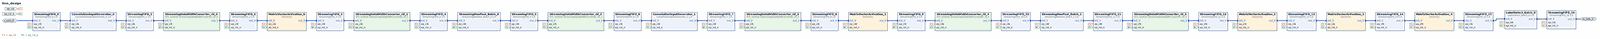
[diagram p0: block diagram of the top level, whole]
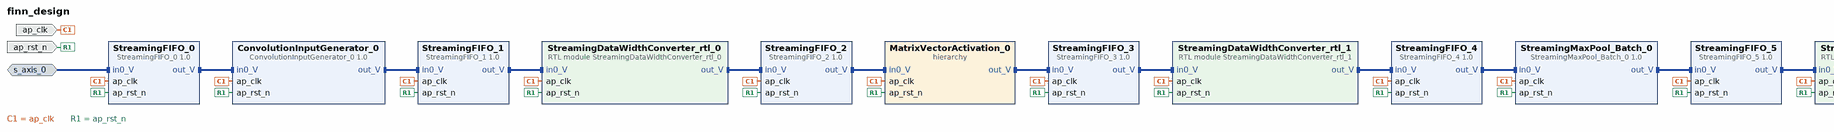
[diagram p1: block diagram of the top level, left part]
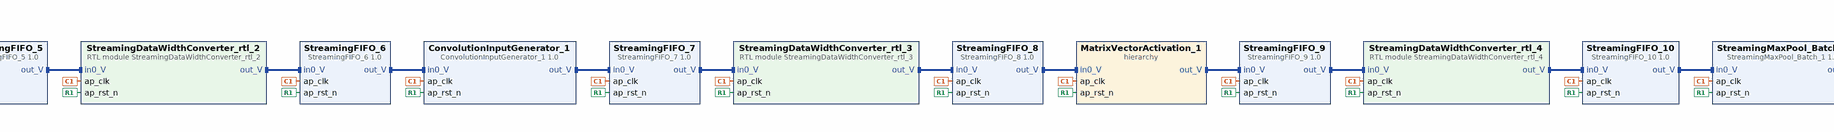
[diagram p2: block diagram of the top level, centre part]
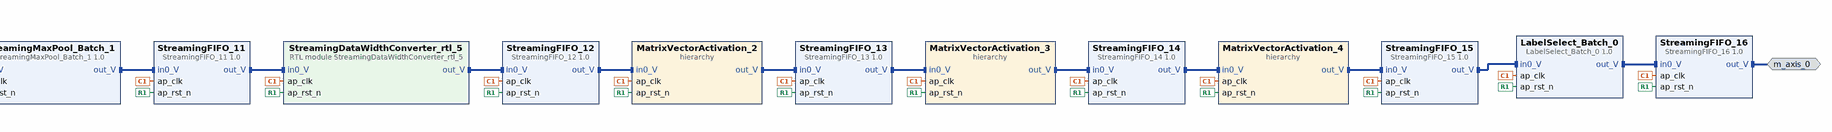
[diagram p3: block diagram of the top level, right part]
# Vivado block design finn_design, xck26-sfvc784-2LV-c, Vivado 2022.1
create_bd_design finn_design

create_bd_intf_port -mode Slave -vlnv xilinx.com:interface:axis_rtl:1.0 s_axis_0
set_property -dict [list \
  CONFIG.HAS_TKEEP 0 \
  CONFIG.HAS_TLAST 0 \
  CONFIG.HAS_TREADY 1 \
  CONFIG.HAS_TSTRB 0 \
  CONFIG.LAYERED_METADATA undef \
  CONFIG.TDATA_NUM_BYTES 1 \
  CONFIG.TDEST_WIDTH 0 \
  CONFIG.TID_WIDTH 0 \
  CONFIG.TUSER_WIDTH 0 \
] [get_bd_intf_ports s_axis_0]
create_bd_intf_port -mode Master -vlnv xilinx.com:interface:axis_rtl:1.0 m_axis_0
create_bd_port -dir I -type clk ap_clk
set_property -dict {CONFIG.FREQ_HZ 100000000} [get_bd_ports ap_clk]
create_bd_port -dir I -type rst ap_rst_n

create_bd_cell -type ip -vlnv xilinx.com:hls:StreamingFIFO_0:1.0 StreamingFIFO_0
create_bd_cell -type ip -vlnv xilinx.com:hls:ConvolutionInputGenerator_0:1.0 ConvolutionInputGenerator_0
create_bd_cell -type ip -vlnv xilinx.com:hls:StreamingFIFO_1:1.0 StreamingFIFO_1
create_bd_cell -type module -reference StreamingDataWidthConverter_rtl_0 StreamingDataWidthConverter_rtl_0
create_bd_cell -type ip -vlnv xilinx.com:hls:StreamingFIFO_2:1.0 StreamingFIFO_2
create_bd_cell -type hier MatrixVectorActivation_0
create_bd_cell -type ip -vlnv xilinx.com:hls:StreamingFIFO_3:1.0 StreamingFIFO_3
create_bd_cell -type module -reference StreamingDataWidthConverter_rtl_1 StreamingDataWidthConverter_rtl_1
create_bd_cell -type ip -vlnv xilinx.com:hls:StreamingFIFO_4:1.0 StreamingFIFO_4
create_bd_cell -type ip -vlnv xilinx.com:hls:StreamingMaxPool_Batch_0:1.0 StreamingMaxPool_Batch_0
create_bd_cell -type ip -vlnv xilinx.com:hls:StreamingFIFO_5:1.0 StreamingFIFO_5
create_bd_cell -type module -reference StreamingDataWidthConverter_rtl_2 StreamingDataWidthConverter_rtl_2
create_bd_cell -type ip -vlnv xilinx.com:hls:StreamingFIFO_6:1.0 StreamingFIFO_6
create_bd_cell -type ip -vlnv xilinx.com:hls:ConvolutionInputGenerator_1:1.0 ConvolutionInputGenerator_1
create_bd_cell -type ip -vlnv xilinx.com:hls:StreamingFIFO_7:1.0 StreamingFIFO_7
create_bd_cell -type module -reference StreamingDataWidthConverter_rtl_3 StreamingDataWidthConverter_rtl_3
create_bd_cell -type ip -vlnv xilinx.com:hls:StreamingFIFO_8:1.0 StreamingFIFO_8
create_bd_cell -type hier MatrixVectorActivation_1
create_bd_cell -type ip -vlnv xilinx.com:hls:StreamingFIFO_9:1.0 StreamingFIFO_9
create_bd_cell -type module -reference StreamingDataWidthConverter_rtl_4 StreamingDataWidthConverter_rtl_4
create_bd_cell -type ip -vlnv xilinx.com:hls:StreamingFIFO_10:1.0 StreamingFIFO_10
create_bd_cell -type ip -vlnv xilinx.com:hls:StreamingMaxPool_Batch_1:1.0 StreamingMaxPool_Batch_1
create_bd_cell -type ip -vlnv xilinx.com:hls:StreamingFIFO_11:1.0 StreamingFIFO_11
create_bd_cell -type module -reference StreamingDataWidthConverter_rtl_5 StreamingDataWidthConverter_rtl_5
create_bd_cell -type ip -vlnv xilinx.com:hls:StreamingFIFO_12:1.0 StreamingFIFO_12
create_bd_cell -type hier MatrixVectorActivation_2
create_bd_cell -type ip -vlnv xilinx.com:hls:StreamingFIFO_13:1.0 StreamingFIFO_13
create_bd_cell -type hier MatrixVectorActivation_3
create_bd_cell -type ip -vlnv xilinx.com:hls:StreamingFIFO_14:1.0 StreamingFIFO_14
create_bd_cell -type hier MatrixVectorActivation_4
create_bd_cell -type ip -vlnv xilinx.com:hls:StreamingFIFO_15:1.0 StreamingFIFO_15
create_bd_cell -type ip -vlnv xilinx.com:hls:LabelSelect_Batch_0:1.0 LabelSelect_Batch_0
create_bd_cell -type ip -vlnv xilinx.com:hls:StreamingFIFO_16:1.0 StreamingFIFO_16

# ---- hierarchy /MatrixVectorActivation_0 ----
current_bd_instance /MatrixVectorActivation_0
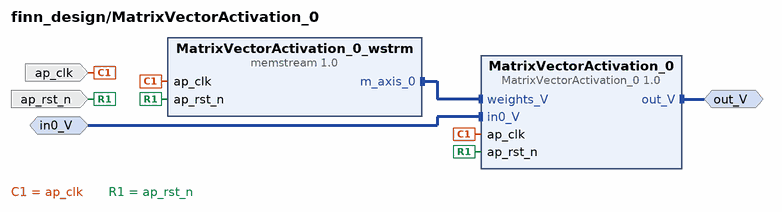
[diagram p4: block diagram inside /MatrixVectorActivation_0]
create_bd_intf_pin -mode Master -vlnv xilinx.com:interface:axis_rtl:1.0 out_V
create_bd_intf_pin -mode Slave -vlnv xilinx.com:interface:axis_rtl:1.0 in0_V
create_bd_pin -dir I -type clk ap_clk
create_bd_pin -dir I -type rst ap_rst_n

create_bd_cell -type ip -vlnv xilinx.com:hls:MatrixVectorActivation_0:1.0 MatrixVectorActivation_0
create_bd_cell -type ip -vlnv amd.com:finn:memstream:1.0 MatrixVectorActivation_0_wstrm
set_property -dict [list \
  CONFIG.DEPTH 6 \
  CONFIG.INIT_FILE /tmp/finn_dev_vboxuser/code_gen_ipgen_MatrixVectorActivation_0_2lsh2_ub/memblock.dat \
  CONFIG.RAM_STYLE auto \
  CONFIG.WIDTH 200 \
] [get_bd_cells MatrixVectorActivation_0_wstrm]

# ---- hierarchy /MatrixVectorActivation_1 ----
current_bd_instance /MatrixVectorActivation_1
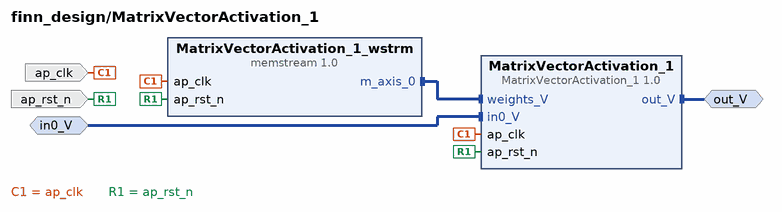
[diagram p5: block diagram inside /MatrixVectorActivation_1]
create_bd_intf_pin -mode Master -vlnv xilinx.com:interface:axis_rtl:1.0 out_V
create_bd_intf_pin -mode Slave -vlnv xilinx.com:interface:axis_rtl:1.0 in0_V
create_bd_pin -dir I -type clk ap_clk
create_bd_pin -dir I -type rst ap_rst_n

create_bd_cell -type ip -vlnv xilinx.com:hls:MatrixVectorActivation_1:1.0 MatrixVectorActivation_1
create_bd_cell -type ip -vlnv amd.com:finn:memstream:1.0 MatrixVectorActivation_1_wstrm
set_property -dict [list \
  CONFIG.DEPTH 160 \
  CONFIG.INIT_FILE /tmp/finn_dev_vboxuser/code_gen_ipgen_MatrixVectorActivation_1_3e8pn67s/memblock.dat \
  CONFIG.RAM_STYLE auto \
  CONFIG.WIDTH 120 \
] [get_bd_cells MatrixVectorActivation_1_wstrm]

# ---- hierarchy /MatrixVectorActivation_2 ----
current_bd_instance /MatrixVectorActivation_2
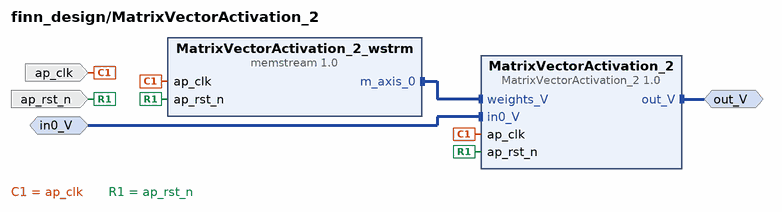
[diagram p6: block diagram inside /MatrixVectorActivation_2]
create_bd_intf_pin -mode Master -vlnv xilinx.com:interface:axis_rtl:1.0 out_V
create_bd_intf_pin -mode Slave -vlnv xilinx.com:interface:axis_rtl:1.0 in0_V
create_bd_pin -dir I -type clk ap_clk
create_bd_pin -dir I -type rst ap_rst_n

create_bd_cell -type ip -vlnv xilinx.com:hls:MatrixVectorActivation_2:1.0 MatrixVectorActivation_2
create_bd_cell -type ip -vlnv amd.com:finn:memstream:1.0 MatrixVectorActivation_2_wstrm
set_property -dict [list \
  CONFIG.DEPTH 12000 \
  CONFIG.INIT_FILE /tmp/finn_dev_vboxuser/code_gen_ipgen_MatrixVectorActivation_2_bhbpvrcf/memblock.dat \
  CONFIG.RAM_STYLE auto \
  CONFIG.WIDTH 32 \
] [get_bd_cells MatrixVectorActivation_2_wstrm]

# ---- hierarchy /MatrixVectorActivation_3 ----
current_bd_instance /MatrixVectorActivation_3
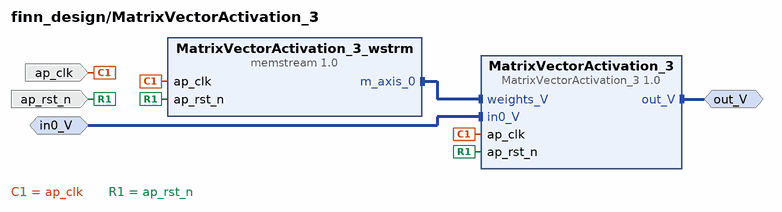
[diagram p7: block diagram inside /MatrixVectorActivation_3]
create_bd_intf_pin -mode Master -vlnv xilinx.com:interface:axis_rtl:1.0 out_V
create_bd_intf_pin -mode Slave -vlnv xilinx.com:interface:axis_rtl:1.0 in0_V
create_bd_pin -dir I -type clk ap_clk
create_bd_pin -dir I -type rst ap_rst_n

create_bd_cell -type ip -vlnv xilinx.com:hls:MatrixVectorActivation_3:1.0 MatrixVectorActivation_3
create_bd_cell -type ip -vlnv amd.com:finn:memstream:1.0 MatrixVectorActivation_3_wstrm
set_property -dict [list \
  CONFIG.DEPTH 10080 \
  CONFIG.INIT_FILE /tmp/finn_dev_vboxuser/code_gen_ipgen_MatrixVectorActivation_3_sp5zjdwm/memblock.dat \
  CONFIG.RAM_STYLE auto \
  CONFIG.WIDTH 8 \
] [get_bd_cells MatrixVectorActivation_3_wstrm]

# ---- hierarchy /MatrixVectorActivation_4 ----
current_bd_instance /MatrixVectorActivation_4
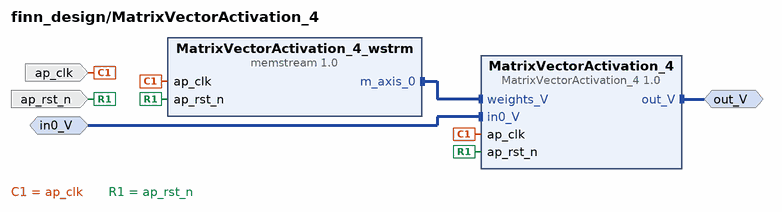
[diagram p8: block diagram inside /MatrixVectorActivation_4]
create_bd_intf_pin -mode Master -vlnv xilinx.com:interface:axis_rtl:1.0 out_V
create_bd_intf_pin -mode Slave -vlnv xilinx.com:interface:axis_rtl:1.0 in0_V
create_bd_pin -dir I -type clk ap_clk
create_bd_pin -dir I -type rst ap_rst_n

create_bd_cell -type ip -vlnv xilinx.com:hls:MatrixVectorActivation_4:1.0 MatrixVectorActivation_4
create_bd_cell -type ip -vlnv amd.com:finn:memstream:1.0 MatrixVectorActivation_4_wstrm
set_property -dict [list \
  CONFIG.DEPTH 840 \
  CONFIG.INIT_FILE /tmp/finn_dev_vboxuser/code_gen_ipgen_MatrixVectorActivation_4_2oobzu4d/memblock.dat \
  CONFIG.RAM_STYLE auto \
  CONFIG.WIDTH 8 \
] [get_bd_cells MatrixVectorActivation_4_wstrm]

# ---- connections ----

current_bd_instance /MatrixVectorActivation_0
connect_bd_intf_net [get_bd_intf_pins out_V] [get_bd_intf_pins MatrixVectorActivation_0/out_V]
connect_bd_intf_net [get_bd_intf_pins MatrixVectorActivation_0_wstrm/m_axis_0] [get_bd_intf_pins MatrixVectorActivation_0/weights_V]
connect_bd_intf_net [get_bd_intf_pins in0_V] [get_bd_intf_pins MatrixVectorActivation_0/in0_V]
connect_bd_net [get_bd_pins ap_clk] [get_bd_pins MatrixVectorActivation_0_wstrm/ap_clk] [get_bd_pins MatrixVectorActivation_0/ap_clk]
connect_bd_net [get_bd_pins ap_rst_n] [get_bd_pins MatrixVectorActivation_0_wstrm/ap_rst_n] [get_bd_pins MatrixVectorActivation_0/ap_rst_n]

current_bd_instance /MatrixVectorActivation_1
connect_bd_intf_net [get_bd_intf_pins out_V] [get_bd_intf_pins MatrixVectorActivation_1/out_V]
connect_bd_intf_net [get_bd_intf_pins MatrixVectorActivation_1_wstrm/m_axis_0] [get_bd_intf_pins MatrixVectorActivation_1/weights_V]
connect_bd_intf_net [get_bd_intf_pins in0_V] [get_bd_intf_pins MatrixVectorActivation_1/in0_V]
connect_bd_net [get_bd_pins ap_clk] [get_bd_pins MatrixVectorActivation_1_wstrm/ap_clk] [get_bd_pins MatrixVectorActivation_1/ap_clk]
connect_bd_net [get_bd_pins ap_rst_n] [get_bd_pins MatrixVectorActivation_1_wstrm/ap_rst_n] [get_bd_pins MatrixVectorActivation_1/ap_rst_n]

current_bd_instance /MatrixVectorActivation_2
connect_bd_intf_net [get_bd_intf_pins out_V] [get_bd_intf_pins MatrixVectorActivation_2/out_V]
connect_bd_intf_net [get_bd_intf_pins MatrixVectorActivation_2_wstrm/m_axis_0] [get_bd_intf_pins MatrixVectorActivation_2/weights_V]
connect_bd_intf_net [get_bd_intf_pins in0_V] [get_bd_intf_pins MatrixVectorActivation_2/in0_V]
connect_bd_net [get_bd_pins ap_clk] [get_bd_pins MatrixVectorActivation_2_wstrm/ap_clk] [get_bd_pins MatrixVectorActivation_2/ap_clk]
connect_bd_net [get_bd_pins ap_rst_n] [get_bd_pins MatrixVectorActivation_2_wstrm/ap_rst_n] [get_bd_pins MatrixVectorActivation_2/ap_rst_n]

current_bd_instance /MatrixVectorActivation_3
connect_bd_intf_net [get_bd_intf_pins out_V] [get_bd_intf_pins MatrixVectorActivation_3/out_V]
connect_bd_intf_net [get_bd_intf_pins MatrixVectorActivation_3_wstrm/m_axis_0] [get_bd_intf_pins MatrixVectorActivation_3/weights_V]
connect_bd_intf_net [get_bd_intf_pins in0_V] [get_bd_intf_pins MatrixVectorActivation_3/in0_V]
connect_bd_net [get_bd_pins ap_clk] [get_bd_pins MatrixVectorActivation_3_wstrm/ap_clk] [get_bd_pins MatrixVectorActivation_3/ap_clk]
connect_bd_net [get_bd_pins ap_rst_n] [get_bd_pins MatrixVectorActivation_3_wstrm/ap_rst_n] [get_bd_pins MatrixVectorActivation_3/ap_rst_n]

current_bd_instance /MatrixVectorActivation_4
connect_bd_intf_net [get_bd_intf_pins out_V] [get_bd_intf_pins MatrixVectorActivation_4/out_V]
connect_bd_intf_net [get_bd_intf_pins MatrixVectorActivation_4_wstrm/m_axis_0] [get_bd_intf_pins MatrixVectorActivation_4/weights_V]
connect_bd_intf_net [get_bd_intf_pins in0_V] [get_bd_intf_pins MatrixVectorActivation_4/in0_V]
connect_bd_net [get_bd_pins ap_clk] [get_bd_pins MatrixVectorActivation_4_wstrm/ap_clk] [get_bd_pins MatrixVectorActivation_4/ap_clk]
connect_bd_net [get_bd_pins ap_rst_n] [get_bd_pins MatrixVectorActivation_4_wstrm/ap_rst_n] [get_bd_pins MatrixVectorActivation_4/ap_rst_n]

current_bd_instance /
connect_bd_intf_net [get_bd_intf_pins ConvolutionInputGenerator_0/out_V] [get_bd_intf_pins StreamingFIFO_1/in0_V]
connect_bd_intf_net [get_bd_intf_pins ConvolutionInputGenerator_1/out_V] [get_bd_intf_pins StreamingFIFO_7/in0_V]
connect_bd_intf_net [get_bd_intf_pins LabelSelect_Batch_0/out_V] [get_bd_intf_pins StreamingFIFO_16/in0_V]
connect_bd_intf_net [get_bd_intf_pins MatrixVectorActivation_0/out_V] [get_bd_intf_pins StreamingFIFO_3/in0_V]
connect_bd_intf_net [get_bd_intf_pins MatrixVectorActivation_1/out_V] [get_bd_intf_pins StreamingFIFO_9/in0_V]
connect_bd_intf_net [get_bd_intf_pins MatrixVectorActivation_2/out_V] [get_bd_intf_pins StreamingFIFO_13/in0_V]
connect_bd_intf_net [get_bd_intf_pins MatrixVectorActivation_3/out_V] [get_bd_intf_pins StreamingFIFO_14/in0_V]
connect_bd_intf_net [get_bd_intf_pins MatrixVectorActivation_4/out_V] [get_bd_intf_pins StreamingFIFO_15/in0_V]
connect_bd_intf_net [get_bd_intf_pins StreamingDataWidthConverter_rtl_0/out_V] [get_bd_intf_pins StreamingFIFO_2/in0_V]
connect_bd_intf_net [get_bd_intf_pins StreamingDataWidthConverter_rtl_1/out_V] [get_bd_intf_pins StreamingFIFO_4/in0_V]
connect_bd_intf_net [get_bd_intf_pins StreamingDataWidthConverter_rtl_2/out_V] [get_bd_intf_pins StreamingFIFO_6/in0_V]
connect_bd_intf_net [get_bd_intf_pins StreamingDataWidthConverter_rtl_3/out_V] [get_bd_intf_pins StreamingFIFO_8/in0_V]
connect_bd_intf_net [get_bd_intf_pins StreamingDataWidthConverter_rtl_4/out_V] [get_bd_intf_pins StreamingFIFO_10/in0_V]
connect_bd_intf_net [get_bd_intf_pins StreamingDataWidthConverter_rtl_5/out_V] [get_bd_intf_pins StreamingFIFO_12/in0_V]
connect_bd_intf_net [get_bd_intf_pins StreamingFIFO_0/out_V] [get_bd_intf_pins ConvolutionInputGenerator_0/in0_V]
connect_bd_intf_net [get_bd_intf_pins StreamingFIFO_10/out_V] [get_bd_intf_pins StreamingMaxPool_Batch_1/in0_V]
connect_bd_intf_net [get_bd_intf_pins StreamingFIFO_11/out_V] [get_bd_intf_pins StreamingDataWidthConverter_rtl_5/in0_V]
connect_bd_intf_net [get_bd_intf_pins StreamingFIFO_12/out_V] [get_bd_intf_pins MatrixVectorActivation_2/in0_V]
connect_bd_intf_net [get_bd_intf_pins StreamingFIFO_13/out_V] [get_bd_intf_pins MatrixVectorActivation_3/in0_V]
connect_bd_intf_net [get_bd_intf_pins StreamingFIFO_14/out_V] [get_bd_intf_pins MatrixVectorActivation_4/in0_V]
connect_bd_intf_net [get_bd_intf_pins StreamingFIFO_15/out_V] [get_bd_intf_pins LabelSelect_Batch_0/in0_V]
connect_bd_intf_net [get_bd_intf_ports m_axis_0] [get_bd_intf_pins StreamingFIFO_16/out_V]
connect_bd_intf_net [get_bd_intf_pins StreamingFIFO_1/out_V] [get_bd_intf_pins StreamingDataWidthConverter_rtl_0/in0_V]
connect_bd_intf_net [get_bd_intf_pins StreamingFIFO_2/out_V] [get_bd_intf_pins MatrixVectorActivation_0/in0_V]
connect_bd_intf_net [get_bd_intf_pins StreamingFIFO_3/out_V] [get_bd_intf_pins StreamingDataWidthConverter_rtl_1/in0_V]
connect_bd_intf_net [get_bd_intf_pins StreamingFIFO_4/out_V] [get_bd_intf_pins StreamingMaxPool_Batch_0/in0_V]
connect_bd_intf_net [get_bd_intf_pins StreamingFIFO_5/out_V] [get_bd_intf_pins StreamingDataWidthConverter_rtl_2/in0_V]
connect_bd_intf_net [get_bd_intf_pins StreamingFIFO_6/out_V] [get_bd_intf_pins ConvolutionInputGenerator_1/in0_V]
connect_bd_intf_net [get_bd_intf_pins StreamingFIFO_7/out_V] [get_bd_intf_pins StreamingDataWidthConverter_rtl_3/in0_V]
connect_bd_intf_net [get_bd_intf_pins StreamingFIFO_8/out_V] [get_bd_intf_pins MatrixVectorActivation_1/in0_V]
connect_bd_intf_net [get_bd_intf_pins StreamingFIFO_9/out_V] [get_bd_intf_pins StreamingDataWidthConverter_rtl_4/in0_V]
connect_bd_intf_net [get_bd_intf_pins StreamingMaxPool_Batch_0/out_V] [get_bd_intf_pins StreamingFIFO_5/in0_V]
connect_bd_intf_net [get_bd_intf_pins StreamingMaxPool_Batch_1/out_V] [get_bd_intf_pins StreamingFIFO_11/in0_V]
connect_bd_intf_net -intf_net in0_V_0_1 [get_bd_intf_ports s_axis_0] [get_bd_intf_pins StreamingFIFO_0/in0_V]
connect_bd_net -net ap_clk_0_1 [get_bd_ports ap_clk] \
  [get_bd_pins StreamingFIFO_0/ap_clk] [get_bd_pins ConvolutionInputGenerator_0/ap_clk] [get_bd_pins StreamingFIFO_1/ap_clk] \
  [get_bd_pins StreamingDataWidthConverter_rtl_0/ap_clk] [get_bd_pins StreamingFIFO_2/ap_clk] \
  [get_bd_pins MatrixVectorActivation_0/ap_clk] [get_bd_pins StreamingFIFO_3/ap_clk] \
  [get_bd_pins StreamingDataWidthConverter_rtl_1/ap_clk] [get_bd_pins StreamingFIFO_4/ap_clk] \
  [get_bd_pins StreamingMaxPool_Batch_0/ap_clk] [get_bd_pins StreamingFIFO_5/ap_clk] \
  [get_bd_pins StreamingDataWidthConverter_rtl_2/ap_clk] [get_bd_pins StreamingFIFO_6/ap_clk] \
  [get_bd_pins ConvolutionInputGenerator_1/ap_clk] [get_bd_pins StreamingFIFO_7/ap_clk] \
  [get_bd_pins StreamingDataWidthConverter_rtl_3/ap_clk] [get_bd_pins StreamingFIFO_8/ap_clk] \
  [get_bd_pins MatrixVectorActivation_1/ap_clk] [get_bd_pins StreamingFIFO_9/ap_clk] \
  [get_bd_pins StreamingDataWidthConverter_rtl_4/ap_clk] [get_bd_pins StreamingFIFO_10/ap_clk] \
  [get_bd_pins StreamingMaxPool_Batch_1/ap_clk] [get_bd_pins StreamingFIFO_11/ap_clk] \
  [get_bd_pins StreamingDataWidthConverter_rtl_5/ap_clk] [get_bd_pins StreamingFIFO_12/ap_clk] \
  [get_bd_pins MatrixVectorActivation_2/ap_clk] [get_bd_pins StreamingFIFO_13/ap_clk] \
  [get_bd_pins MatrixVectorActivation_3/ap_clk] [get_bd_pins StreamingFIFO_14/ap_clk] \
  [get_bd_pins MatrixVectorActivation_4/ap_clk] [get_bd_pins StreamingFIFO_15/ap_clk] \
  [get_bd_pins LabelSelect_Batch_0/ap_clk] [get_bd_pins StreamingFIFO_16/ap_clk]
connect_bd_net -net ap_rst_n_0_1 [get_bd_ports ap_rst_n] \
  [get_bd_pins StreamingFIFO_0/ap_rst_n] [get_bd_pins ConvolutionInputGenerator_0/ap_rst_n] \
  [get_bd_pins StreamingFIFO_1/ap_rst_n] [get_bd_pins StreamingDataWidthConverter_rtl_0/ap_rst_n] \
  [get_bd_pins StreamingFIFO_2/ap_rst_n] [get_bd_pins MatrixVectorActivation_0/ap_rst_n] \
  [get_bd_pins StreamingFIFO_3/ap_rst_n] [get_bd_pins StreamingDataWidthConverter_rtl_1/ap_rst_n] \
  [get_bd_pins StreamingFIFO_4/ap_rst_n] [get_bd_pins StreamingMaxPool_Batch_0/ap_rst_n] \
  [get_bd_pins StreamingFIFO_5/ap_rst_n] [get_bd_pins StreamingDataWidthConverter_rtl_2/ap_rst_n] \
  [get_bd_pins StreamingFIFO_6/ap_rst_n] [get_bd_pins ConvolutionInputGenerator_1/ap_rst_n] \
  [get_bd_pins StreamingFIFO_7/ap_rst_n] [get_bd_pins StreamingDataWidthConverter_rtl_3/ap_rst_n] \
  [get_bd_pins StreamingFIFO_8/ap_rst_n] [get_bd_pins MatrixVectorActivation_1/ap_rst_n] \
  [get_bd_pins StreamingFIFO_9/ap_rst_n] [get_bd_pins StreamingDataWidthConverter_rtl_4/ap_rst_n] \
  [get_bd_pins StreamingFIFO_10/ap_rst_n] [get_bd_pins StreamingMaxPool_Batch_1/ap_rst_n] \
  [get_bd_pins StreamingFIFO_11/ap_rst_n] [get_bd_pins StreamingDataWidthConverter_rtl_5/ap_rst_n] \
  [get_bd_pins StreamingFIFO_12/ap_rst_n] [get_bd_pins MatrixVectorActivation_2/ap_rst_n] \
  [get_bd_pins StreamingFIFO_13/ap_rst_n] [get_bd_pins MatrixVectorActivation_3/ap_rst_n] \
  [get_bd_pins StreamingFIFO_14/ap_rst_n] [get_bd_pins MatrixVectorActivation_4/ap_rst_n] \
  [get_bd_pins StreamingFIFO_15/ap_rst_n] [get_bd_pins LabelSelect_Batch_0/ap_rst_n] [get_bd_pins StreamingFIFO_16/ap_rst_n]

validate_bd_design
save_bd_design
